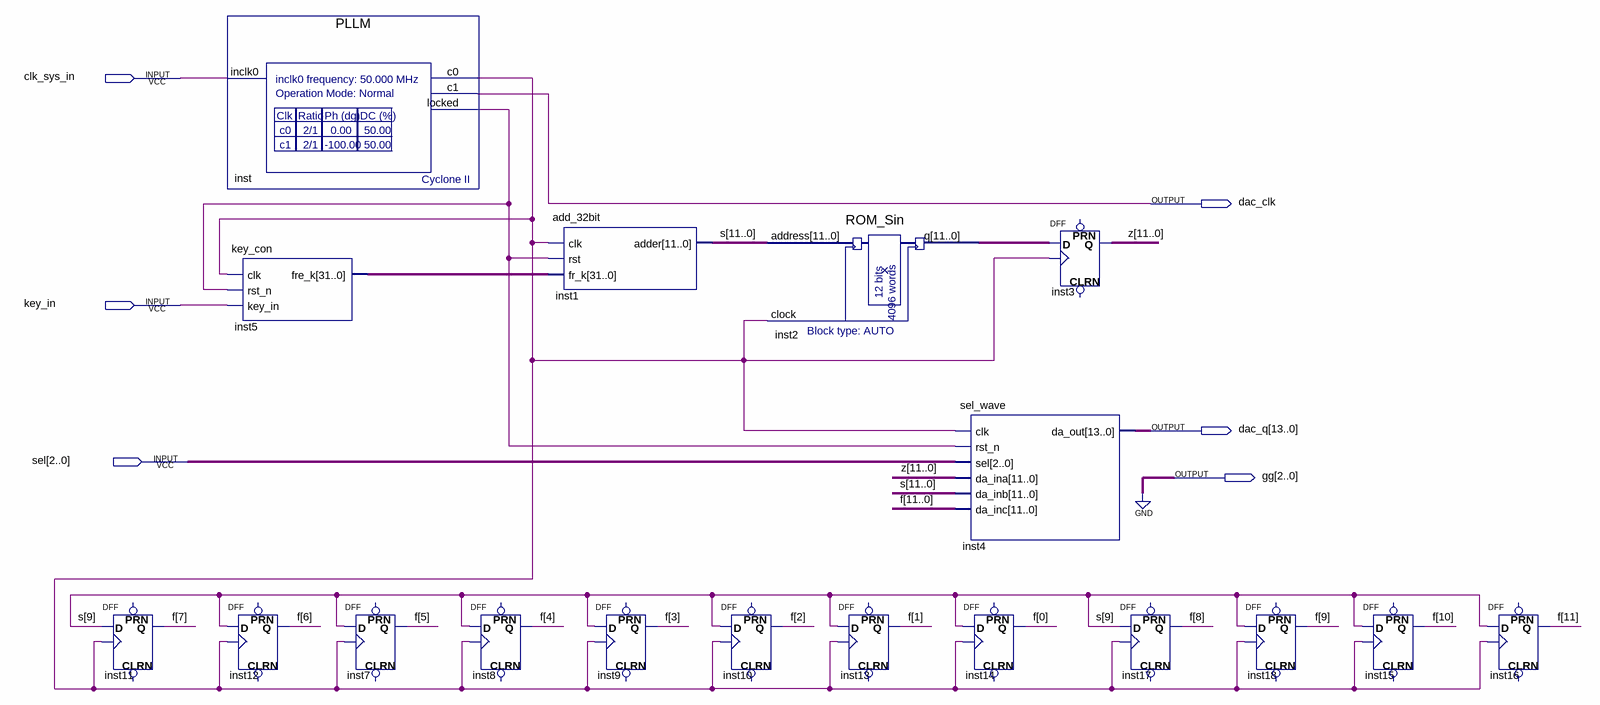
[diagram p0: schematic sheet]
// Quartus schematic AD9708_TEST_Code.bdf as structural Verilog: 18 symbols, 6 pins
module AD9708_TEST_Code (
  input  clk_sys_in,
  input  key_in,
  input  [2:0] sel,
  output dac_clk,
  output [13:0] dac_q,
  output [2:0] gg
);

  wire inst_c0, inst_locked;
  wire [11:0] f, inst2_q, s, z;
  wire [31:0] inst5_fre_k;

  DFF inst11 (.CLK(inst_c0), .D(s[9]), .Q(f[7]));  // open: CLRN, PRN
  PLLM inst (.inclk0(clk_sys_in), .c0(inst_c0), .c1(dac_clk), .locked(inst_locked));
  key_con inst5 (.clk(inst_c0), .rst_n(inst_locked), .key_in(key_in), .fre_k(inst5_fre_k));
  DFF inst12 (.CLK(inst_c0), .D(s[9]), .Q(f[6]));  // open: CLRN, PRN
  DFF inst7 (.CLK(inst_c0), .D(s[9]), .Q(f[5]));  // open: CLRN, PRN
  DFF inst8 (.CLK(inst_c0), .D(s[9]), .Q(f[4]));  // open: CLRN, PRN
  add_32bit inst1 (.clk(inst_c0), .rst(inst_locked), .fr_k(inst5_fre_k), .adder(s));
  DFF inst9 (.CLK(inst_c0), .D(s[9]), .Q(f[3]));  // open: CLRN, PRN
  DFF inst10 (.CLK(inst_c0), .D(s[9]), .Q(f[2]));  // open: CLRN, PRN
  ROM_Sin inst2 (.address(s), .clock(inst_c0), .q(inst2_q));
  DFF inst13 (.CLK(inst_c0), .D(s[9]), .Q(f[1]));  // open: CLRN, PRN
  sel_wave inst4 (.clk(inst_c0), .rst_n(inst_locked), .sel(sel), .da_ina(z), .da_inb(s), .da_inc(f), .da_out(dac_q));
  DFF inst14 (.CLK(inst_c0), .D(s[9]), .Q(f[0]));  // open: CLRN, PRN
  DFF inst3[11:0] (.CLK(inst_c0), .D(inst2_q), .Q(z));  // open: CLRN, PRN
  DFF inst17 (.CLK(inst_c0), .D(s[9]), .Q(f[8]));  // open: CLRN, PRN
  DFF inst18 (.CLK(inst_c0), .D(s[9]), .Q(f[9]));  // open: CLRN, PRN
  DFF inst15 (.CLK(inst_c0), .D(s[9]), .Q(f[10]));  // open: CLRN, PRN
  DFF inst16 (.CLK(inst_c0), .D(s[9]), .Q(f[11]));  // open: CLRN, PRN

  assign gg = 3'b000;
endmodule
